# Altium schematic sheet Interboard.SchDoc: FMC-320U-B0  VWR0R0
size A4; Author: Daniel H Sagarra; CompanyName: FLOWMEET SRL
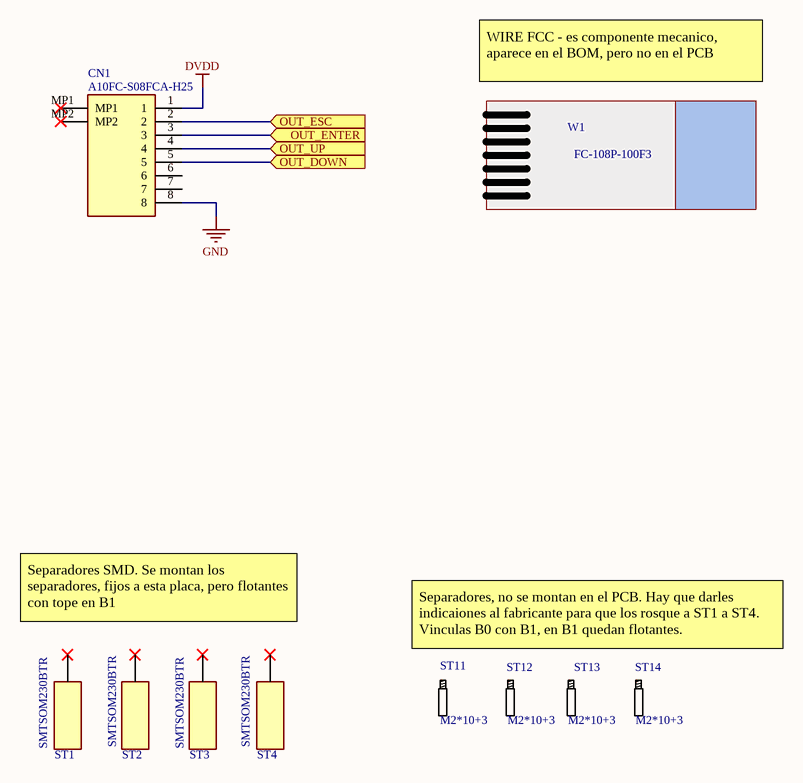
[diagram p0: Interboard.SchDoc]

## Parts
CN1  A10FC-S08FCA-H25  [849528]
ST1  SMTSOM230BTR  [SMTSOM266BTR]
ST2  SMTSOM230BTR  [SMTSOM266BTR]
ST3  SMTSOM230BTR  [SMTSOM266BTR]
ST4  SMTSOM230BTR  [SMTSOM266BTR]
ST11  M2*10+3  [C193465]  (mechanical)
ST12  M2*10+3  [C193465]  (mechanical)
ST13  M2*10+3  [C193465]  (mechanical)
ST14  M2*10+3  [C193465]  (mechanical)
W1  FC-108P-100F3  [no_footprint]  (mechanical)

## Ports
OUT_DOWN (in), OUT_ENTER (in), OUT_ESC (in), OUT_UP (in)

## Nets
DVDD: CN1.1
GND: CN1.8
OUT_DOWN: CN1.5 ; port OUT_DOWN
OUT_ENTER: CN1.3 ; port OUT_ENTER
OUT_ESC: CN1.2 ; port OUT_ESC
OUT_UP: CN1.4 ; port OUT_UP

Not connected (* = marked no-connect by the designer): CN1 6 7 MP1* MP2*; ST1 MH1*; ST2 MH1*; ST3 MH1*; ST4 MH1*

## Notes on the sheet
- WIRE FCC - es componente mecanico, aparece en el BOM, pero no en el PCB
- Separadores SMD. Se montan los separadores, fijos a esta placa, pero flotantes con tope en B1
- Separadores, no se montan en el PCB. Hay que darles indicaiones al fabricante para que los rosque a ST1 a ST4. Vinculas B0 con B1, en B1 quedan flotantes.

## Library data of the parts
CN1 = A10FC-S08FCA-H25: FFC/FPC Connector 8 Position 1mm Pitch Bottom Contact Surface Mount, Right Angle -40℃~+85℃; Manufacturer: JXTCONN; Vendor Part Number: C42447839; Vendor: LCSC; Manufacturer Part Number: A10FC-S08FCA-H25; Price: 0.089
ST1-ST4 = SMTSOM230BTR: Standoffs & Spacers SURFACE MOUNT STANDOFF; Manufacturer: Yiyuan; Vendor Part Number: C5221851; Vendor: LCSC; Manufacturer Part Number: SMTSOM230BTR; Price: 0.0652
ST11-ST14 = M2*10+3: Standoff. Mechanical part. Install manually. Not included in pick-and-place assembly.; Manufacturer: XHHD; Vendor: LCSC; PCBA: Standoff.  no PCB footprint. Please source and include in PCBA assemblyMechanical part. Install manually IN ST1, ST2, ST3 and ST4.; Manufacturer Part Number: M2*10+3; Vendor Part Number: C193465; Price: 0.014
W1 = FC-108P-100F3: FFC - Flat Flex cable connector; Manufacturer: JXTCONN; Vendor: LCSC; PCBA: Off-board cable/wire – no PCB footprint. Please source and include in PCBA assembly; Vendor Part Number: FC-108P-100F3; Manufacturer Part Number: FC-108P-100F3; Price: 0.042